# EasyEDA schematic SCH_DIY-PICO-USB-GADGET.json
TITLE: Sheet_1; REV: 1.0; Date: 2024-06-07; Sheet: 1/1; Drawn By: dhitikarora; Company: DTECH
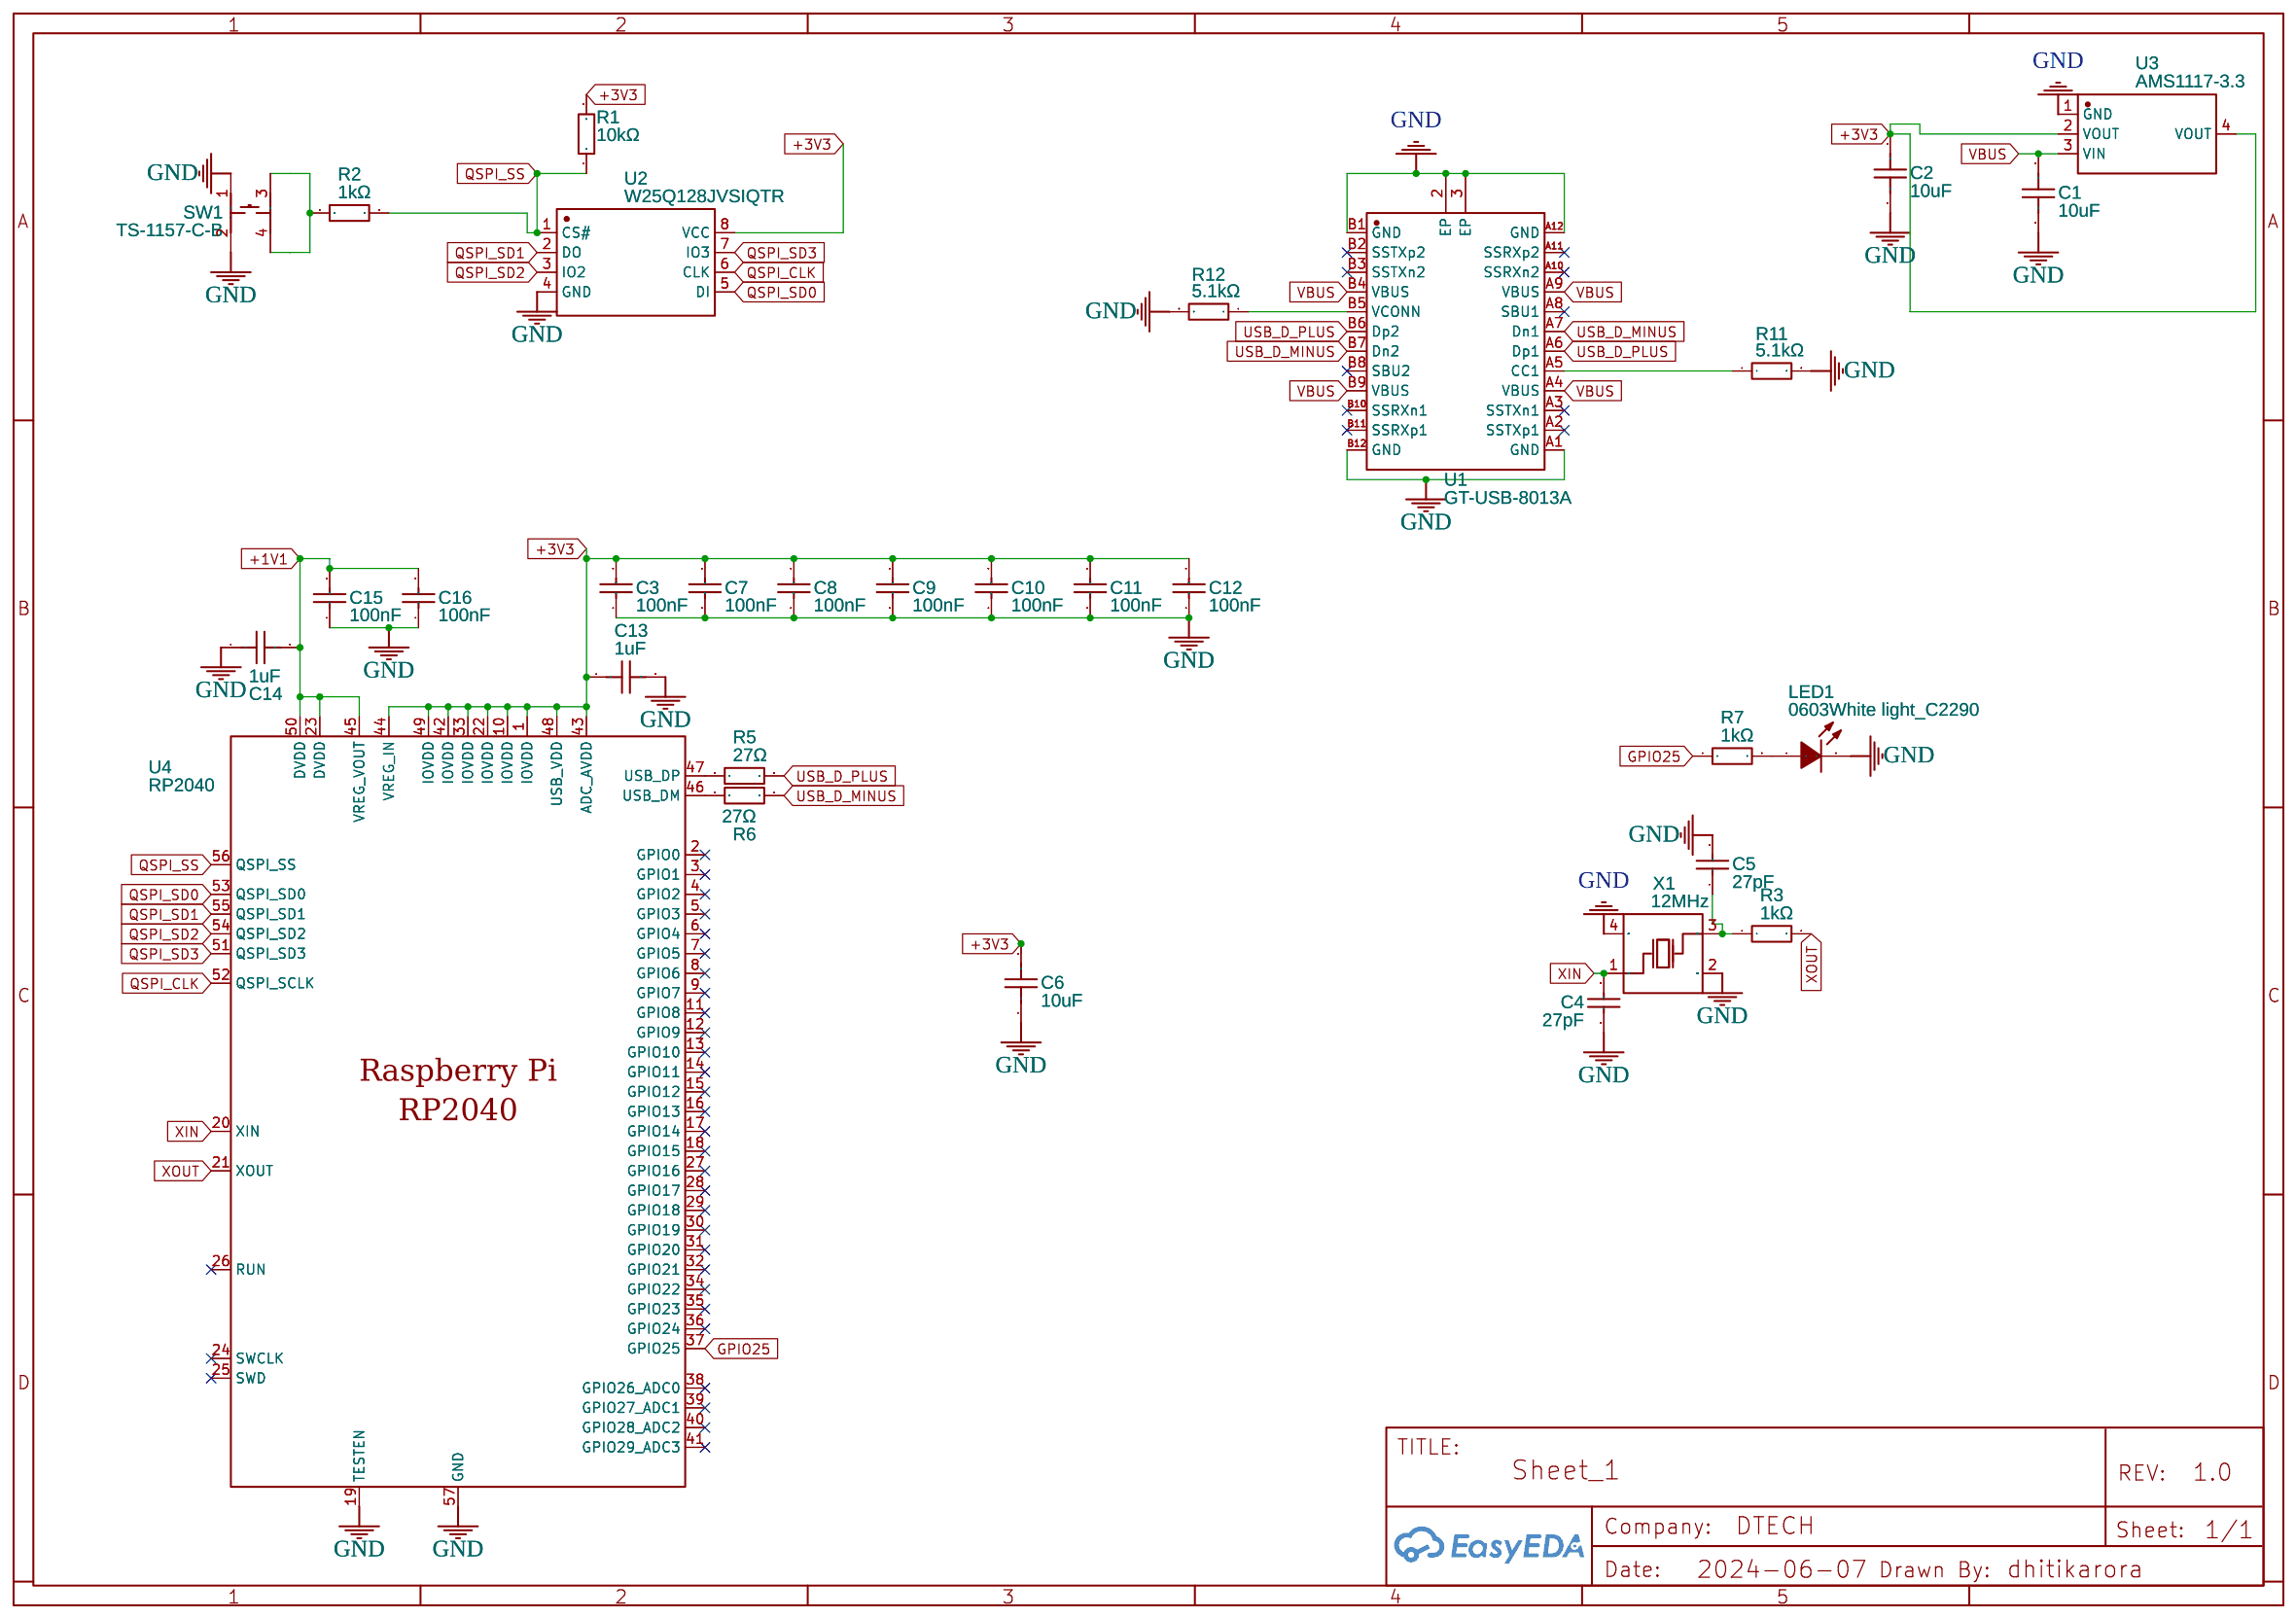
[diagram p0: schematic sheet]

## Parts
C1  10uF  [C0603]
C2  10uF  [C0603]
C3  100nF  [C0402]
C4  27pF  [C0603]
C5  27pF  [C0603]
C6  10uF  [C0603]
C7  100nF  [C0402]
C8  100nF  [C0402]
C9  100nF  [C0402]
C10  100nF  [C0402]
C11  100nF  [C0402]
C12  100nF  [C0402]
C13  1uF  [C0402]
C14  1uF  [C0402]
C15  100nF  [C0402]
C16  100nF  [C0402]
LED1  0603White light_C2290  [LED0603-R-RD_WHITE]
R1  10kΩ  [R0402]
R2  1kΩ  [R0402]
R3  1kΩ  [R0402]
R5  27Ω  [R0805]
R6  27Ω  [R0805]
R7  1kΩ  [R0402]
R11  5.1kΩ  [R0402]
R12  5.1kΩ  [R0402]
SW1  TS-1157-C-B  [KEY-SMD_4P-L6.5-W6.2-P4.50--LS8.5-TL]
U1  GT-USB-8013A  [USB-C-SMD_GT-USB-8013A]
U2  W25Q128JVSIQTR  [SOIC-8_L5.3-W5.3-P1.27-LS8.0-BL]
U3  AMS1117-3.3  [SOT-223-3_L6.5-W3.4-P2.30-LS7.0-BR]
U4  RP2040  [LQFN-56_L7.0-W7.0-P0.4-EP]
X1  12MHz  [OSC-SMD_4P-L3.2-W2.5-BL]

## Library data of the parts
C1 C2 C6 = CL10A106KP8NNNC: Supplier: LCSC; Manufacturer: SAMSUNG(三星); Supplier Part: C19702; JLCPCB Part Class: Basic Part
C3 C7-C12 C15 C16 = CL05B104KO5NNNC: Supplier: LCSC; Manufacturer: SAMSUNG(三星); Supplier Part: C1525; JLCPCB Part Class: Basic Part
C4 C5 = CC0603JRNPO9BN270: Supplier: LCSC; Manufacturer: YAGEO(国巨); Supplier Part: C107045; JLCPCB Part Class: Extended Part
C13 C14 = CL05A105KA5NQNC: Supplier: LCSC; Manufacturer: SAMSUNG(三星); Supplier Part: C52923; JLCPCB Part Class: Basic Part
LED1 = 0603White light_C2290: Supplier: LCSC; Manufacturer: KENTO; Manufacturer Part: KT-0603白灯; Supplier Part: C2290; JLCPCB Part Class: Basic Part
R1 = 0402WGF1002TCE: Supplier: LCSC; Manufacturer: UNI-ROYAL(厚声); Supplier Part: C25744; JLCPCB Part Class: Basic Part
R2 R3 R7 = 0402WGF1001TCE: Supplier: LCSC; Manufacturer: UNI-ROYAL(厚声); Supplier Part: C11702; JLCPCB Part Class: Basic Part
R5 R6 = 0805W8F270JT5E: Supplier: LCSC; Manufacturer: UNI-ROYAL(厚声); Supplier Part: C17594; JLCPCB Part Class: Extended Part
R11 R12 = RTT02512JTH: Supplier: LCSC; Manufacturer: RALEC(旺诠); Supplier Part: C103086; Resistance (Ohms): 5.1K; JLCPCB Part Class: Extended Part
SW1 = TS-1157-C-B: Contributor: LCSC; Supplier: LCSC; Supplier Part: C500082; Manufacturer: XKB Connectivity(中国星坤); JLCPCB Part Class: Extended Part
U1 = GT-USB-8013A: Supplier: LCSC; Supplier Part: C2988370; Manufacturer: G-Switch(品赞); Contributor: lcsc; JLCPCB Part Class: Extended Part
U2 = W25Q128JVSIQTR: Supplier: LCSC; Manufacturer: WINBOND(华邦); Manufacturer Part: W25Q128JVSIQ; Supplier Part: C97521; JLCPCB Part Class: Basic Part
U3 = AMS1117-3.3: sourceId: dwIGgezVh; Supplier: LCSC; Manufacturer: AMS; Supplier Part: C6186; JLCPCB Part Class: Basic Part
U4 = RP2040: Contributor: LCSC; Supplier: LCSC; Supplier Part: C2040; Manufacturer: Raspberry Pi(树莓派); JLCPCB Part Class: Extended Part
X1 = X322512MSB4SI: Supplier: LCSC; Manufacturer: YXC(扬兴晶振); Supplier Part: C9002; JLCPCB Part Class: Basic Part

## Nets
+1V1: C14.2 C15.2 C16.2 U4.23(DVDD) U4.45(VREG_VOUT) U4.50(DVDD)
+3V3: C2.2 C3.2 C6.2 C7.2 C8.2 C9.2 C10.2 C11.2 C12.2 C13.1 R1.2 U2.8(VCC) U3.2(VOUT) U3.4(VOUT) U4.1(IOVDD) U4.10(IOVDD) U4.22(IOVDD) U4.33(IOVDD) U4.42(IOVDD) U4.43(ADC_AVDD) U4.44(VREG_IN) U4.48(USB_VDD) U4.49(IOVDD)
GND: C1.1 C2.1 C3.1 C4.1 C5.2 C6.1 C7.1 C8.1 C9.1 C10.1 C11.1 C12.1 C13.2 C14.1 C15.1 C16.1 LED1.2(K) R11.2 R12.2 SW1.1 SW1.2 U1.2(EP) U1.3(EP) U1.A1(GND) U1.A12(GND) U1.B1(GND) U1.B12(GND) U2.4(GND) U3.1(GND) U4.19(TESTEN) U4.57(GND) X1.2(GND) X1.4(GND)
VBUS: C1.2 U1.A4(VBUS) U1.A9(VBUS) U1.B4(VBUS) U1.B9(VBUS) U3.3(VIN)
GPIO25: R7.1 U4.37(GPIO25)
QSPI_CLK: U2.6(CLK) U4.52(QSPI_SCLK)
QSPI_SD0: U2.5(DI) U4.53(QSPI_SD0)
QSPI_SD1: U2.2(DO) U4.55(QSPI_SD1)
QSPI_SD2: U2.3(IO2) U4.54(QSPI_SD2)
QSPI_SD3: U2.7(IO3) U4.51(QSPI_SD3)
QSPI_SS: R1.1 R2.2 U2.1(CS#) U4.56(QSPI_SS)
USB_D_MINUS: R6.1 U1.A7(Dn1) U1.B7(Dn2)
USB_D_PLUS: R5.2 U1.A6(Dp1) U1.B6(Dp2)
XIN: C4.2 U4.20(XIN) X1.1(OSC1)
XOUT: R3.2 U4.21(XOUT)
Net-(C5-1): C5.1 R3.1 X1.3(OSC2)
Net-(LED1-1): LED1.1(A) R7.2
Net-(R2-1): R2.1 SW1.3 SW1.4
Net-(R5-1): R5.1 U4.47(USB_DP)
Net-(R6-2): R6.2 U4.46(USB_DM)
Net-(R11-1): R11.1 U1.A5(CC1)
Net-(R12-1): R12.1 U1.B5(VCONN)

Not connected (* = marked no-connect by the designer): U1 A2(SSTXp1)* A3(SSTXn1)* A8(SBU1)* A10(SSRXn2)* A11(SSRXp2)* B2(SSTXp2)* B3(SSTXn2)* B8(SBU2)* B10(SSRXn1)* B11(SSRXp1)*; U4 2(GPIO0)* 3(GPIO1)* 4(GPIO2)* 5(GPIO3)* 6(GPIO4)* 7(GPIO5)* 8(GPIO6)* 9(GPIO7)* 11(GPIO8)* 12(GPIO9)* 13(GPIO10)* 14(GPIO11)* 15(GPIO12)* 16(GPIO13)* 17(GPIO14)* 18(GPIO15)* 24(SWCLK)* 25(SWD)* 26(RUN)* 27(GPIO16)* 28(GPIO17)* 29(GPIO18)* 30(GPIO19)* 31(GPIO20)* 32(GPIO21)* 34(GPIO22)* 35(GPIO23)* 36(GPIO24)* 38(GPIO26_ADC0)* 39(GPIO27_ADC1)* 40(GPIO28_ADC2)* 41(GPIO29_ADC3)*
